# EAGLE design O4MEGA (EAGLE 7.0.0)
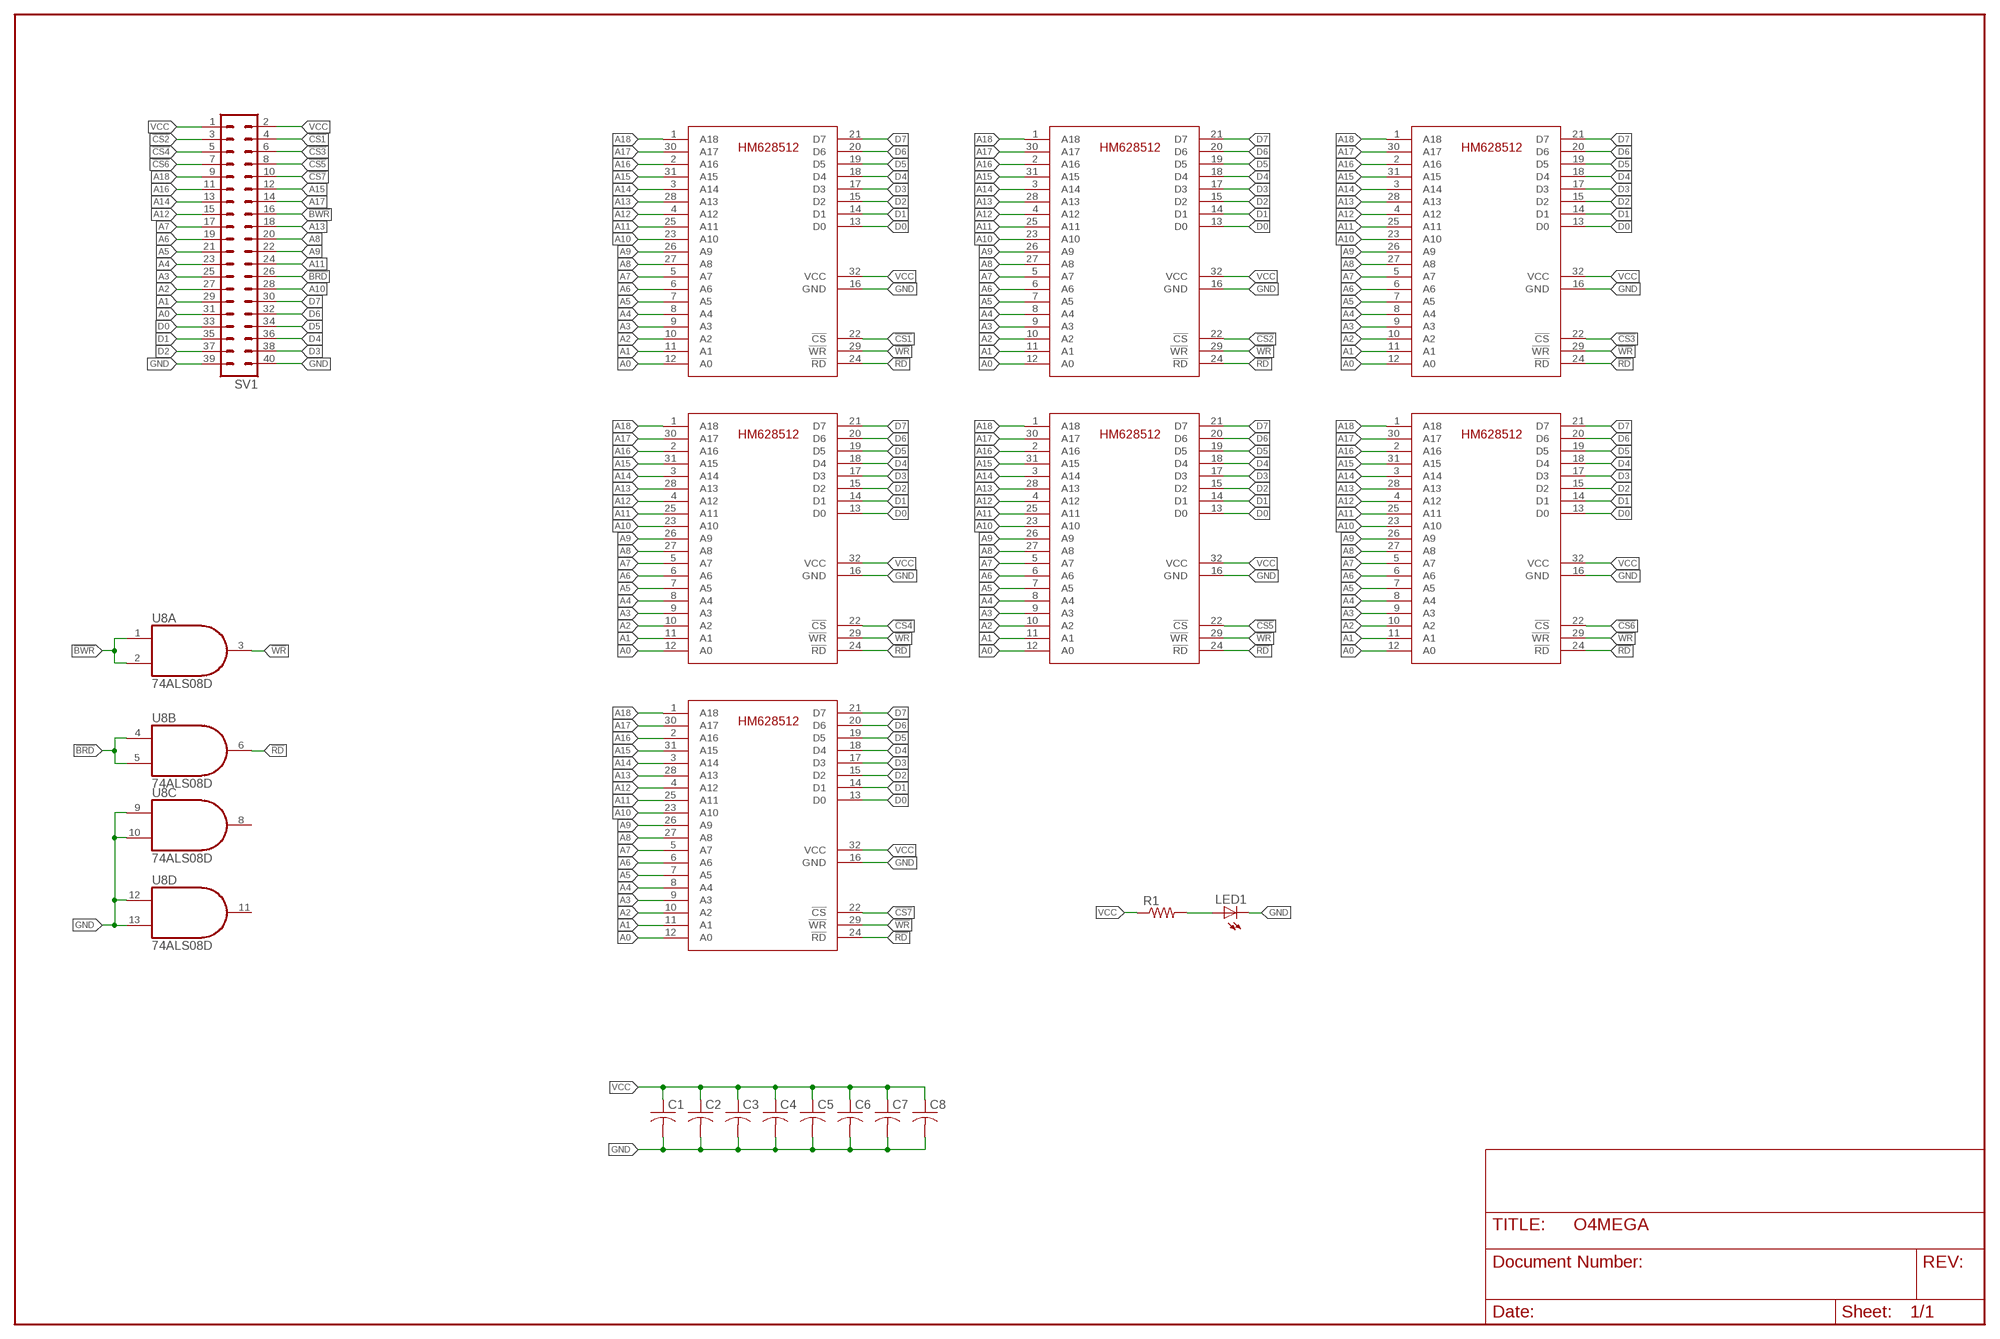
[diagram p0: schematic, sheet 1]

## Parts
C1  C-USC0805K  [C0805K]
C2  C-USC0805K  [C0805K]
C3  C-USC0805K  [C0805K]
C4  C-USC0805K  [C0805K]
C5  C-USC0805K  [C0805K]
C6  C-USC0805K  [C0805K]
C7  C-USC0805K  [C0805K]
C8  C-USC0805K  [C0805K]
LED1  LEDCHIP-LED0805  [CHIP-LED0805]
R1  R-US_M0805  [M0805]
SV1  MA20-2  [MA20-2]
U1  HM628512  [SOP32L]
U2  HM628512  [SOP32L]
U3  HM628512  [SOP32L]
U4  HM628512  [SOP32L]
U5  HM628512  [SOP32L]
U6  HM628512  [SOP32L]
U7  HM628512  [SOP32L]
U8  74ALS08D  [SO14]

## Nets
!BRD: SV1.26 U8.4(B:I0) U8.5(B:I1)
!BWR: SV1.16 U8.1(A:I0) U8.2(A:I1)
!CS1: SV1.4 U1.22(!CS)
!CS2: SV1.3 U2.22(!CS)
!CS3: SV1.6 U3.22(!CS)
!CS4: SV1.5 U4.22(!CS)
!CS5: SV1.8 U5.22(!CS)
!CS6: SV1.7 U6.22(!CS)
!CS7: SV1.10 U7.22(!CS)
!RD: U1.24(!RD) U2.24(!RD) U3.24(!RD) U4.24(!RD) U5.24(!RD) U6.24(!RD) U7.24(!RD) U8.6(B:O)
!WR: U1.29(!WR) U2.29(!WR) U3.29(!WR) U4.29(!WR) U5.29(!WR) U6.29(!WR) U7.29(!WR) U8.3(A:O)
A0: SV1.31 U1.12(A0) U2.12(A0) U3.12(A0) U4.12(A0) U5.12(A0) U6.12(A0) U7.12(A0)
A1: SV1.29 U1.11(A1) U2.11(A1) U3.11(A1) U4.11(A1) U5.11(A1) U6.11(A1) U7.11(A1)
A2: SV1.27 U1.10(A2) U2.10(A2) U3.10(A2) U4.10(A2) U5.10(A2) U6.10(A2) U7.10(A2)
A3: SV1.25 U1.9(A3) U2.9(A3) U3.9(A3) U4.9(A3) U5.9(A3) U6.9(A3) U7.9(A3)
A4: SV1.23 U1.8(A4) U2.8(A4) U3.8(A4) U4.8(A4) U5.8(A4) U6.8(A4) U7.8(A4)
A5: SV1.21 U1.7(A5) U2.7(A5) U3.7(A5) U4.7(A5) U5.7(A5) U6.7(A5) U7.7(A5)
A6: SV1.19 U1.6(A6) U2.6(A6) U3.6(A6) U4.6(A6) U5.6(A6) U6.6(A6) U7.6(A6)
A7: SV1.17 U1.5(A7) U2.5(A7) U3.5(A7) U4.5(A7) U5.5(A7) U6.5(A7) U7.5(A7)
A8: SV1.20 U1.27(A8) U2.27(A8) U3.27(A8) U4.27(A8) U5.27(A8) U6.27(A8) U7.27(A8)
A9: SV1.22 U1.26(A9) U2.26(A9) U3.26(A9) U4.26(A9) U5.26(A9) U6.26(A9) U7.26(A9)
A10: SV1.28 U1.23(A10) U2.23(A10) U3.23(A10) U4.23(A10) U5.23(A10) U6.23(A10) U7.23(A10)
A11: SV1.24 U1.25(A11) U2.25(A11) U3.25(A11) U4.25(A11) U5.25(A11) U6.25(A11) U7.25(A11)
A12: SV1.15 U1.4(A12) U2.4(A12) U3.4(A12) U4.4(A12) U5.4(A12) U6.4(A12) U7.4(A12)
A13: SV1.18 U1.28(A13) U2.28(A13) U3.28(A13) U4.28(A13) U5.28(A13) U6.28(A13) U7.28(A13)
A14: SV1.13 U1.3(A14) U2.3(A14) U3.3(A14) U4.3(A14) U5.3(A14) U6.3(A14) U7.3(A14)
A15: SV1.12 U1.31(A15) U2.31(A15) U3.31(A15) U4.31(A15) U5.31(A15) U6.31(A15) U7.31(A15)
A16: SV1.11 U1.2(A16) U2.2(A16) U3.2(A16) U4.2(A16) U5.2(A16) U6.2(A16) U7.2(A16)
A17: SV1.14 U1.30(A17) U2.30(A17) U3.30(A17) U4.30(A17) U5.30(A17) U6.30(A17) U7.30(A17)
A18: SV1.9 U1.1(A18) U2.1(A18) U3.1(A18) U4.1(A18) U5.1(A18) U6.1(A18) U7.1(A18)
D0: SV1.33 U1.13(D0) U2.13(D0) U3.13(D0) U4.13(D0) U5.13(D0) U6.13(D0) U7.13(D0)
D1: SV1.35 U1.14(D1) U2.14(D1) U3.14(D1) U4.14(D1) U5.14(D1) U6.14(D1) U7.14(D1)
D2: SV1.37 U1.15(D2) U2.15(D2) U3.15(D2) U4.15(D2) U5.15(D2) U6.15(D2) U7.15(D2)
D3: SV1.38 U1.17(D3) U2.17(D3) U3.17(D3) U4.17(D3) U5.17(D3) U6.17(D3) U7.17(D3)
D4: SV1.36 U1.18(D4) U2.18(D4) U3.18(D4) U4.18(D4) U5.18(D4) U6.18(D4) U7.18(D4)
D5: SV1.34 U1.19(D5) U2.19(D5) U3.19(D5) U4.19(D5) U5.19(D5) U6.19(D5) U7.19(D5)
D6: SV1.32 U1.20(D6) U2.20(D6) U3.20(D6) U4.20(D6) U5.20(D6) U6.20(D6) U7.20(D6)
D7: SV1.30 U1.21(D7) U2.21(D7) U3.21(D7) U4.21(D7) U5.21(D7) U6.21(D7) U7.21(D7)
GND: C1.2 C2.2 C3.2 C4.2 C5.2 C6.2 C7.2 C8.2 LED1.C SV1.39 SV1.40 U1.16(GND) U2.16(GND) U3.16(GND) U4.16(GND) U5.16(GND) U6.16(GND) U7.16(GND) U8.9(C:I0) U8.10(C:I1) U8.12(D:I0) U8.13(D:I1)
N$1: LED1.A R1.2
VCC: C1.1 C2.1 C3.1 C4.1 C5.1 C6.1 C7.1 C8.1 R1.1 SV1.1 SV1.2 U1.32(VCC) U2.32(VCC) U3.32(VCC) U4.32(VCC) U5.32(VCC) U6.32(VCC) U7.32(VCC)
Unconnected: U8.8(C:O) U8.11(D:O)

## Power pins joined to a net without a drawn wire
GND: U8.7(P:GND)
VCC: U8.14(P:VCC)

## Library data of the parts
C1-C8 = rcl:C-US: CAPACITOR, American symbol
LED1 = led:LED: LED OSRAM: - CHIPLED LG R971, LG N971, LY N971, LG Q971, LY Q971, LO R971, LY R971 LH N974, LH R974 LS Q976, LO Q976, LY Q976 LO Q996 - Hyper CHIPLED LW Q18S LB Q993, LB Q99A, LB R99A - SideLED LS A670, LO A670, LY A670, LG A670, LP A670 LB A673, LV A673, LT A673, LW A673 LH A674 LY A675 LS A676, LA A676, LO A676, LY A676, LW A676 LS A679, LY A679, LG A679 - Hyper Micro SIDELED® LS Y876, LA Y876, LO Y876, LY Y876 LT Y87S - SmartLED LW L88C, LW L88S LB L89C, LB L89S, LG L890 LS L89K, LO L89K, LY L89K LS L896, LA L896, LO L896, LY L896 - TOPLED LS T670, LO T670, LY T670, LG T670, LP T670 LSG T670, LSP T670, LSY T670, LOP T670, LYG T670 LG T671, LOG T671, LSG T671 LB T673, LV T673, LT T673, LW T673 LH T674 LS T676, LA T676, LO T676, LY T676, LB T676, LH T676, LSB T676, LW T676 LB T67C, LV T67C, LT T67C, LS T67K, LO T67K, LY T67K, LW E67C LS E67B, LA E67B, LO E67B, LY E67B, LB E67C, LV E67C, LT E67C LW T67C LS T679, LY T679, LG T679 LS T770, LO T770, LY T770, LG T770, LP T770 LB T773, LV T773, LT T773, LW T773 LH T774 LS E675, LA E675, LY E675, LS T675 LS T776, LA T776, LO T776, LY T776, LB T776 LHGB T686 LT T68C, LB T68C - Hyper Mini TOPLED® LB M676 - Mini TOPLED Santana® LG M470 LS M47K, LO M47K, LY M47K Source: http://www.osram.convergy.de LUXEON: - LUMILED® LXK2-PW12-R00, LXK2-PW12-S00, LXK2-PW14-U00, LXK2-PW14-V00 LXK2-PM12-R00, LXK2-PM12-S00, LXK2-PM14-U00 LXK2-PE12-Q00, LXK2-PE12-R00, LXK2-PE12-S00, LXK2-PE14-T00, LXK2-PE14-U00 LXK2-PB12-K00, LXK2-PB12-L00, LXK2-PB12-M00, LXK2-PB14-N00, LXK2-PB14-P00, LXK2-PB14-Q00 LXK2-PR12-L00, LXK2-PR12-M00, LXK2-PR14-Q00, LXK2-PR14-R00 LXK2-PD12-Q00, LXK2-PD12-R00, LXK2-PD12-S00 LXK2-PH12-R00, LXK2-PH12-S00 LXK2-PL12-P00, LXK2-PL12-Q00, LXK2-PL12-R00 Source: www.luxeon.com KINGBRIGHT: KA-3528ASYC Source: www.kingbright.com
R1 = rcl:R-US_: RESISTOR, American symbol
SV1 = con-lstb:MA20-2: PIN HEADER; OC_FARNELL: unknown; OC_NEWARK: unknown
U1-U7 = memory:HM628512
U8 = 74xx-us:74*08: Quad 2-input AND gate

## Board
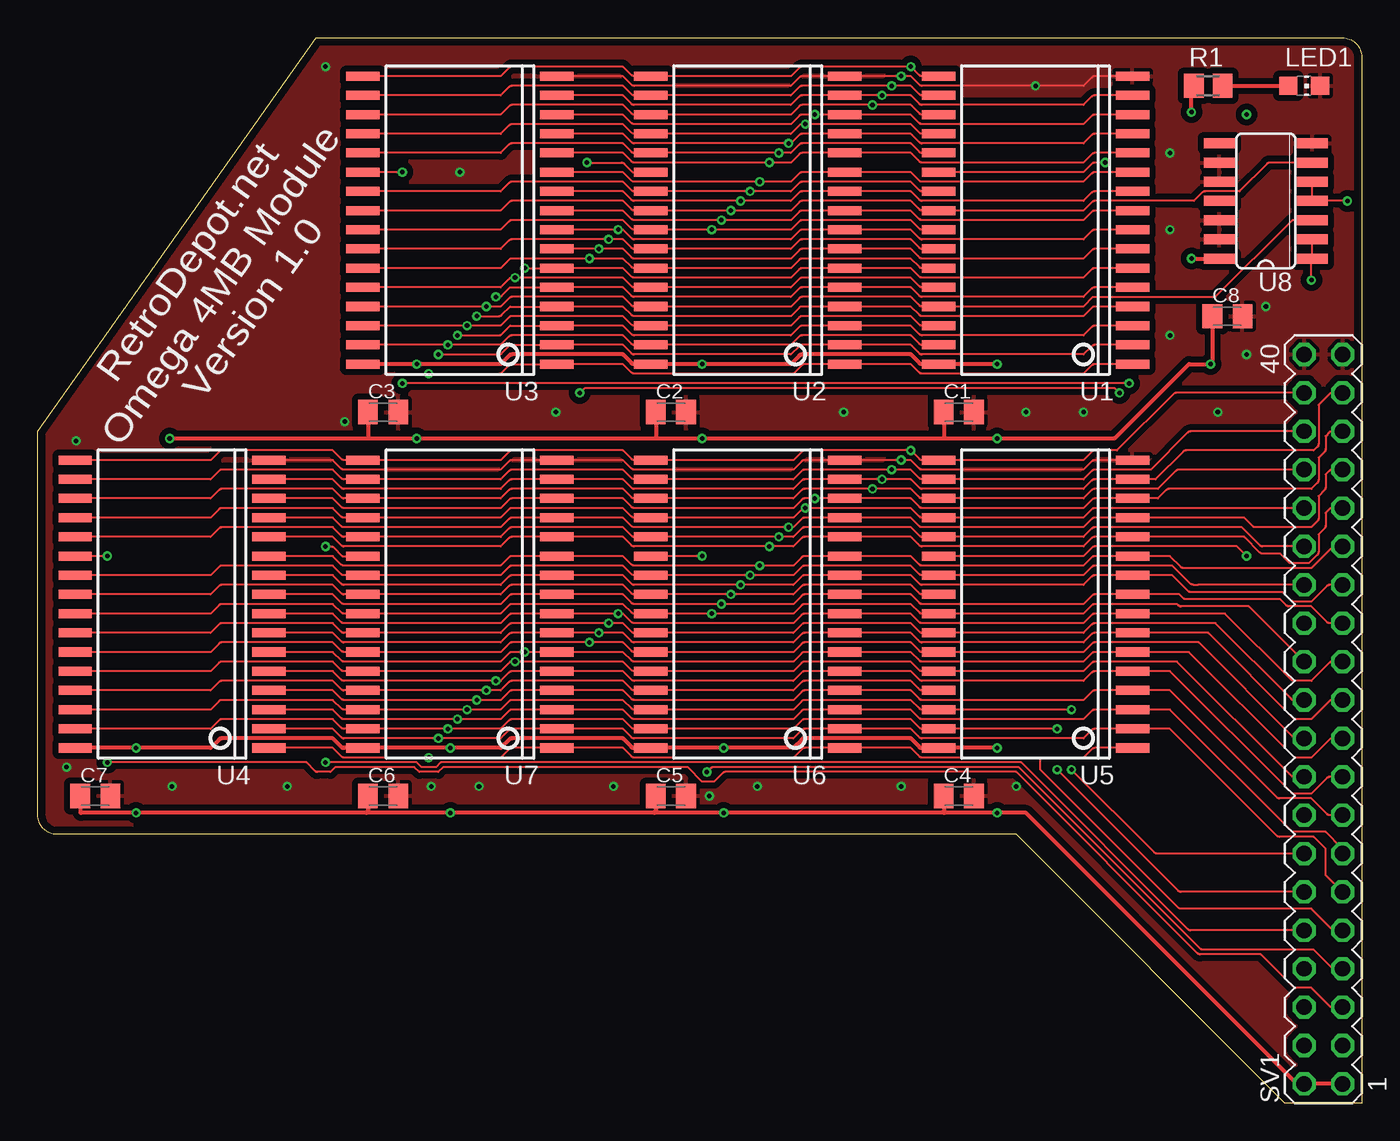
[diagram p1: board, top side]
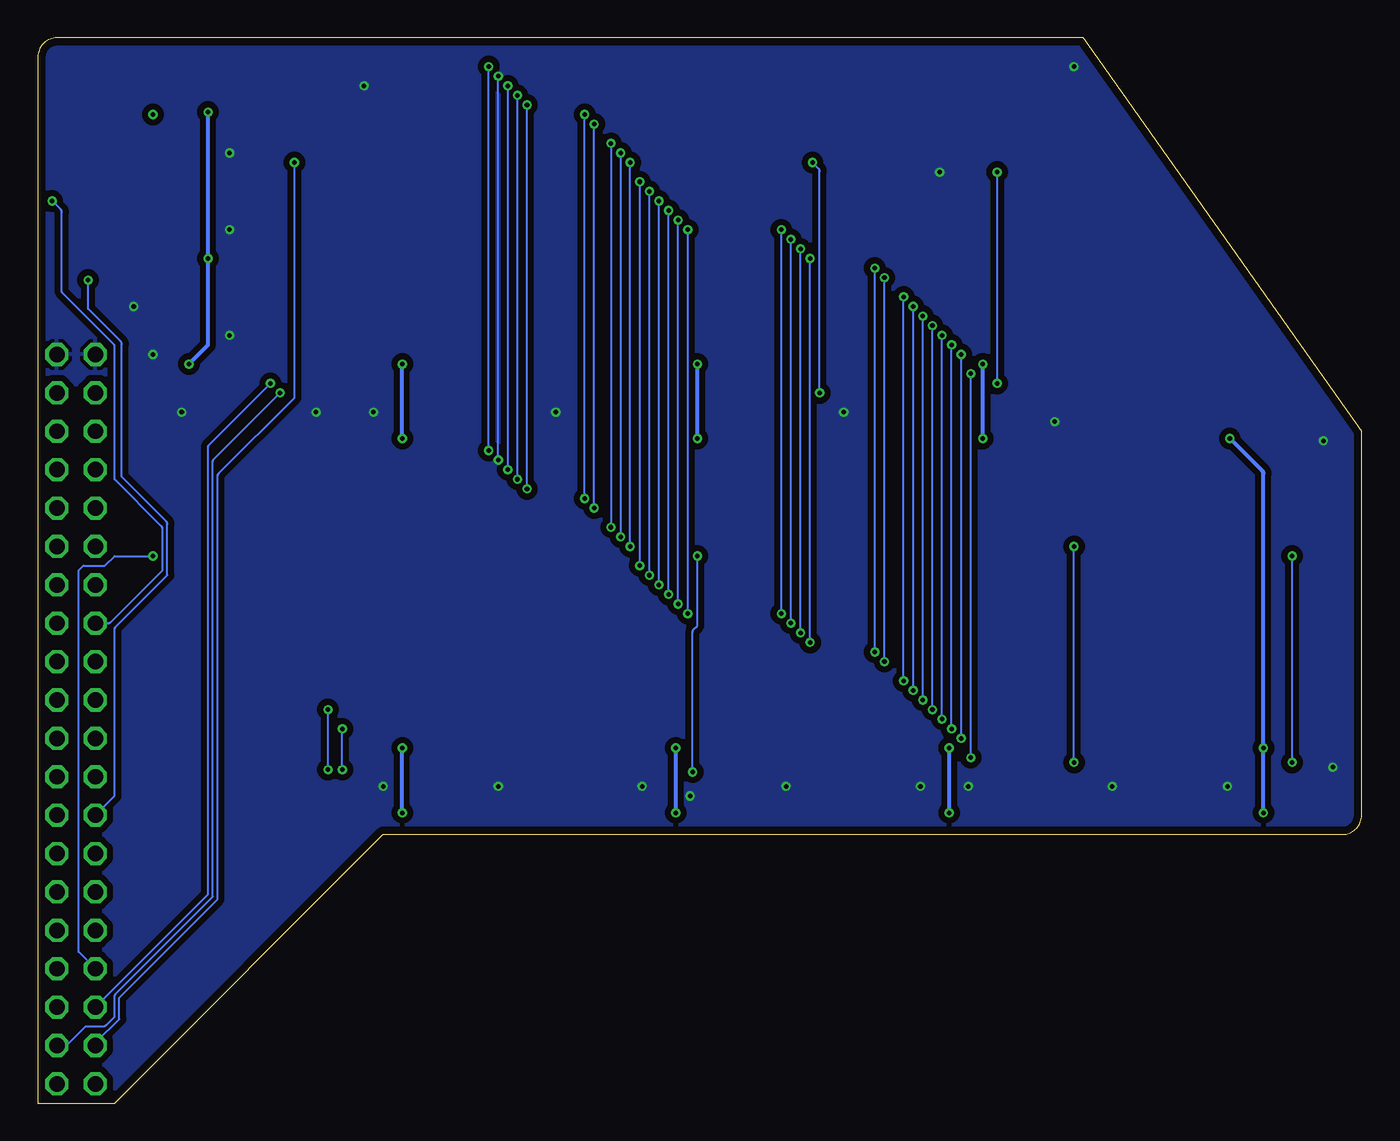
[diagram p2: board, bottom side, seen from below]

Size 87.63 x 70.48 mm. Coordinates in mm from the lower left corner, seen from the top.
Outline: 87.63,0 82.55,0 64.77,17.78 1.27,17.78 arc-90 0,19.05 0,44.45 18.41,70.48 86.36,70.48 arc-90 87.63,69.22 87.63,0
Copper layers (1*16): Top 0.035mm / dielectric 1.5mm / Bottom 0.035mm
Design rules "default *": minimum track width 5mil, minimum drill 0.2mm, track to track 5mil, track to pad 5mil, pad to pad 5mil, via to via 5mil, smd to smd 0mil, copper to edge 20mil, drill to drill 5mil, minimum pad ring 6mil, minimum via ring 6mil, stop-mask expansion 0mil, vias tented up to drill 25mil, thermal gap 10mil

### Footprints (pad centres in the part's own frame; a part is rotated, then mirrored left to right if it is on the bottom)
C0805K = smd 1.3 x 1.6: 1 -1,0; 2 1,0
CHIP-LED0805 = smd 1.2 x 1.2: A 0,-1.05; C 0,1.05
M0805 = smd 1.3 x 1.6: 1 -0.95,0; 2 0.95,0
MA20-2 = drill 1.016 octagon: 1 -24.13,-1.27; 2 -24.13,1.27; 3 -21.59,-1.27; 4 -21.59,1.27; 5 -19.05,-1.27; 6 -19.05,1.27; 7 -16.51,-1.27; 8 -16.51,1.27; 9 -13.97,-1.27; 10 -13.97,1.27; 11 -11.43,-1.27; 12 -11.43,1.27; 13 -8.89,-1.27; 14 -8.89,1.27; 15 -6.35,-1.27; 16 -6.35,1.27; 17 -3.81,-1.27; 18 -3.81,1.27; 19 -1.27,-1.27; 20 -1.27,1.27; 21 1.27,-1.27; 22 1.27,1.27; 23 3.81,-1.27; 24 3.81,1.27; 25 6.35,-1.27; 26 6.35,1.27; 27 8.89,-1.27; 28 8.89,1.27; 29 11.43,-1.27; 30 11.43,1.27; 31 13.97,-1.27; 32 13.97,1.27; 33 16.51,-1.27; 34 16.51,1.27; 35 19.05,-1.27; 36 19.05,1.27; 37 21.59,-1.27; 38 21.59,1.27; 39 24.13,-1.27; 40 24.13,1.27
SOP32L = smd 0.6 x 2.2: 1 -9.525,-6.416; 2 -8.255,-6.416; 3 -6.985,-6.416; 4 -5.715,-6.416; 5 -4.445,-6.416; 6 -3.175,-6.416; 7 -1.905,-6.416; 8 -0.635,-6.416; 9 0.635,-6.416; 10 1.905,-6.416; 11 3.175,-6.416; 12 4.445,-6.416; 13 5.715,-6.416; 14 6.985,-6.416; 15 8.255,-6.416; 16 9.525,-6.416; 17 9.525,6.416; 18 8.255,6.416; 19 6.985,6.416; 20 5.715,6.416; 21 4.445,6.416; 22 3.175,6.416; 23 1.905,6.416; 24 0.635,6.416; 25 -0.635,6.416; 26 -1.905,6.416; 27 -3.175,6.416; 28 -4.445,6.416; 29 -5.715,6.416; 30 -6.985,6.416; 31 -8.255,6.416; 32 -9.525,6.416
SO14 = smd 0.66 x 2.032: 1 -3.81,-3.073; 2 -2.54,-3.073; 3 -1.27,-3.073; 4 0,-3.073; 5 1.27,-3.073; 6 2.54,-3.073; 7 3.81,-3.073; 8 3.81,3.073; 9 2.54,3.073; 10 1.27,3.073; 11 0,3.073; 12 -1.27,3.073; 13 -2.54,3.073; 14 -3.81,3.073

### Placement (x,y rotation side)
C1  60.96,45.72 0 top
C2  41.91,45.72 0 top
C3  22.86,45.72 0 top
C4  60.96,20.32 0 top
C5  41.91,20.32 0 top
C6  22.86,20.32 0 top
C7  3.81,20.32 0 top
C8  78.74,52.07 0 top
LED1  83.82,67.31 270 top
R1  77.47,67.31 0 top
SV1  85.09,25.4 90 top
U1  66.04,58.42 90 top
U2  46.99,58.42 90 top
U3  27.94,58.42 90 top
U4  8.89,33.02 90 top
U5  66.04,33.02 90 top
U6  46.99,33.02 90 top
U7  27.94,33.02 90 top
U8  81.28,59.69 90 top

### Tracks (layer width: path | path; a pad name or v marks a point on that pad's centre or on a via)
!BRD  (via drill 0.3 pad 0.5)
  Top 0.127: v86.68,59.69 U8.4 U8.5
  Bottom 0.127: SV1.26 82.97,31.75 arc-45 82.79,31.82 79.38,35.24 79.38,37.99 arc-45 79.45,38.17 82.55,41.27 82.55,50.06 arc-45 82.62,50.24 86.04,53.66 86.04,58.95 arc-45 86.12,59.13 v86.68,59.69
!BWR  (via drill 0.3 pad 0.5)
  Top 0.127: v84.3,54.45 84.3,55.74 arc-45 U8.1 U8.2
  Bottom 0.127: SV1.16 82.55,20.32 82.55,31.33 arc45 82.48,31.51 79.06,34.92 79.06,38.31 arc-45 79.13,38.49 82.07,41.43 82.07,50.22 arc-45 82.15,50.4 84.3,52.55 v84.3,54.45
!CS1  (via drill 0.3 pad 0.5)
  Top 0.127: v70.64,62.23 69.95,62.23 arc45 69.78,62.16 69.22,61.59 U1.22
  Bottom 0.127: SV1.4 83.82,3.86 arc45 83.75,4.04 82.23,5.56 82.23,6.99 75.72,13.49 75.72,41.49 arc45 75.65,41.67 70.64,46.67 v70.64,62.23
!CS2  (via drill 0.3 pad 0.5)
  Top 0.127: v71.6,46.99 71.28,47.31 36.2,47.31 v35.88,46.99 | v36.35,62.23 38.63,62.23 arc-45 38.81,62.16 39.37,61.59 U2.22
  Bottom 0.127: SV1.3 85.83,3.81 arc-45 85.65,3.88 84.45,5.08 83.29,5.08 arc-45 83.11,5.15 82.55,5.71 82.55,7.04 arc45 82.48,7.22 76.04,13.65 76.04,42.44 arc45 75.97,42.62 v71.6,46.99 | v35.88,46.99 35.88,61.65 arc-45 35.95,61.83 v36.35,62.23
!CS3  (via drill 0.3 pad 0.5)
  Top 0.127: v72.23,47.62 v24.13,47.62 | v24.13,61.59 U3.22
  Bottom 0.127: SV1.6 76.36,13.81 76.36,43.39 arc45 76.28,43.57 v72.23,47.62 | v24.13,47.62 v24.13,61.59
!CS4  (via drill 0.3 pad 0.5)
  Top 0.127: SV1.5 85.67,6.35 arc-45 85.49,6.42 84.3,7.62 83.29,7.62 arc-45 83.11,7.69 80.96,9.84 76.94,9.84 arc-45 76.76,9.92 64.77,21.91 45.51,21.91 arc45 45.33,21.83 44.77,21.27 43.97,21.27 43.02,22.23 26.83,22.23 26.51,21.91 25.24,21.91 24.92,22.23 19.68,22.23 19.37,21.91 18.52,21.91 arc-45 18.34,21.98 17.78,22.54 v4.6,22.54 | v4.6,36.2 U4.22
  Bottom 0.127: v4.6,22.54 v4.6,36.2
!CS5  (via drill 0.3 pad 0.5)
  Top 0.127: v80.01,36.2 79.38,36.83 69.95,36.83 arc45 69.78,36.76 69.22,36.2 U5.22
  Bottom 0.127: SV1.8 84.93,10 84.93,35.24 84.61,35.56 83.19,35.56 82.55,36.2 v80.01,36.2
!CS6  (via drill 0.3 pad 0.5)
  Top 0.127: SV1.7 85.83,8.89 arc-45 85.65,8.96 84.45,10.16 77.1,10.16 arc-45 76.92,10.23 64.93,22.23 44.71,22.23 arc45 44.53,22.15 v44.29,21.91 | v43.97,36.2 U6.22
  Bottom 0.127: v44.29,21.91 44.29,31.17 arc45 44.22,31.35 43.97,31.59 v43.97,36.2
!CS7  (via drill 0.3 pad 0.5)
  Top 0.127: SV1.10 76.31,11.43 arc-45 76.13,11.5 65.09,22.54 26.67,22.54 26.35,22.23 25.4,22.23 25.08,22.54 v19.05,22.54 | v19.05,36.83 19.42,36.83 arc-45 19.6,36.76 20.16,36.2 U7.22
  Bottom 0.127: v19.05,22.54 v19.05,36.83
!RD  (via drill 0.3 pad 0.5)
  Top 0.127: U3.24 30.64,59.05 31.2,59.62 arc-45 31.38,59.69 38.73,59.69 39.3,59.13 arc45 39.48,59.05 U2.24 v45.88,59.05 49.85,59.05 50.41,59.62 arc-45 50.59,59.69 57.78,59.69 58.35,59.13 arc45 58.52,59.05 U1.24 69.22,59.05 69.78,59.62 arc-45 69.95,59.69 76.52,59.69 77.08,60.25 arc-45 77.26,60.33 79.53,60.33 81.36,62.16 arc-45 81.54,62.23 U8.6 | U5.24 58.52,33.66 arc-45 58.35,33.73 57.78,34.29 50.75,34.29 arc45 50.57,34.22 50.01,33.66 v45.88,33.66 U6.24 39.48,33.66 arc-45 39.3,33.73 38.73,34.29 31.38,34.29 arc45 31.2,34.22 30.64,33.66 U7.24 20.27,33.66 arc-45 20.09,33.73 19.53,34.29 12.17,34.29 arc45 11.99,34.22 11.43,33.66 U4.24
  Bottom 0.127: v45.88,33.66 v45.88,59.05
!WR  (via drill 0.3 pad 0.5)
  Top 0.127: U3.29 v29.69,52.7 30.64,52.7 31.2,53.27 arc-45 31.38,53.34 38.73,53.34 39.3,52.78 arc45 39.48,52.7 U2.29 49.85,52.7 50.41,53.27 arc-45 50.59,53.34 57.78,53.34 58.35,52.78 arc45 58.52,52.7 U1.29 69.22,52.7 69.85,53.34 77.95,53.34 82.95,58.35 arc-45 83.13,58.42 U8.3 | U5.29 58.52,27.3 arc-45 58.35,27.38 57.78,27.94 50.75,27.94 arc45 50.57,27.87 50.01,27.3 U6.29 39.48,27.3 arc-45 39.3,27.38 38.73,27.94 31.38,27.94 arc45 31.2,27.87 30.64,27.3 v29.69,27.3 U7.29 20.27,27.3 arc-45 20.09,27.38 19.53,27.94 12.17,27.94 arc45 11.99,27.87 11.43,27.3 U4.29
  Bottom 0.127: v29.69,27.3 v29.69,52.7
A0  (via drill 0.3 pad 0.5)
  Top 0.127: U1.12 69.95,62.87 arc45 69.78,62.79 69.22,62.23 58.52,62.23 arc-45 58.35,62.3 57.78,62.87 U2.12 50.59,62.87 arc45 50.41,62.79 49.85,62.23 v48.42,62.23 39.48,62.23 arc-45 39.3,62.3 38.73,62.87 U3.12 | U4.12 19.53,37.47 20.09,36.9 arc45 20.27,36.83 30.64,36.83 31.2,37.39 arc-45 31.38,37.47 U7.12 38.73,37.47 39.3,36.9 arc45 39.48,36.83 v48.42,36.83 50.01,36.83 50.57,37.39 arc-45 50.75,37.47 U6.12 57.78,37.47 58.35,36.9 arc45 58.52,36.83 69.22,36.83 69.78,37.39 arc-45 69.95,37.47 U5.12 79.85,37.47 80.89,36.43 arc45 81.07,36.35 82.23,36.35 82.79,35.79 arc45 82.97,35.72 84.14,35.72 84.7,36.28 arc45 84.77,36.46 84.77,37.62 85.17,38.03 arc45 85.25,38.2 85.25,39.05 85.49,39.3 arc-45 85.67,39.37 SV1.31
  Bottom 0.127: v48.42,36.83 v48.42,62.23
A1  (via drill 0.3 pad 0.5)
  Top 0.127: U1.11 69.95,61.59 arc45 69.78,61.52 69.22,60.96 58.52,60.96 arc-45 58.35,61.03 57.78,61.59 U2.11 50.59,61.59 arc45 50.41,61.52 49.85,60.96 v47.78,60.96 39.48,60.96 arc-45 39.3,61.03 38.73,61.59 U3.11 | U4.11 19.53,36.2 20.09,35.63 arc45 20.27,35.56 30.64,35.56 31.2,36.12 arc-45 31.38,36.2 U7.11 38.73,36.2 39.3,35.63 arc45 39.48,35.56 v47.78,35.56 50.01,35.56 50.57,36.12 arc-45 50.75,36.2 U6.11 57.78,36.2 58.35,35.63 arc45 58.52,35.56 69.22,35.56 69.78,36.12 arc-45 69.95,36.2 U5.11 74.93,36.2 75.65,35.48 arc45 75.83,35.4 84.3,35.4 85.65,36.76 arc-45 85.83,36.83 SV1.29
  Bottom 0.127: v47.78,35.56 v47.78,60.96
A2  (via drill 0.3 pad 0.5)
  Top 0.127: U1.10 69.95,60.33 arc45 69.78,60.25 69.22,59.69 58.52,59.69 arc-45 58.35,59.76 57.78,60.33 U2.10 50.59,60.33 arc45 50.41,60.25 49.85,59.69 v46.51,59.69 39.48,59.69 arc-45 39.3,59.76 38.73,60.33 U3.10 | U4.10 19.53,34.92 20.09,34.36 arc45 20.27,34.29 30.64,34.29 31.2,34.85 arc-45 31.38,34.92 U7.10 38.73,34.92 39.3,34.36 arc45 39.48,34.29 v46.51,34.29 50.01,34.29 50.57,34.85 arc-45 50.75,34.92 U6.10 57.78,34.92 58.35,34.36 arc45 58.52,34.29 69.22,34.29 69.78,34.85 arc-45 69.95,34.92 U5.10 75.09,34.92 76.13,33.89 arc45 76.31,33.81 82.39,33.81 82.95,33.25 arc45 83.13,33.18 84.3,33.18 85.33,34.22 arc-45 85.51,34.29 SV1.27
  Bottom 0.127: v46.51,34.29 v46.51,59.69
A3  (via drill 0.3 pad 0.5)
  Top 0.127: U1.9 69.95,59.05 arc45 69.78,58.98 69.22,58.42 58.52,58.42 arc-45 58.35,58.49 57.78,59.05 U2.9 50.59,59.05 arc45 50.41,58.98 49.85,58.42 v45.24,58.42 39.48,58.42 arc-45 39.3,58.49 38.73,59.05 U3.9 | U4.9 19.53,33.66 20.09,33.09 arc45 20.27,33.02 30.64,33.02 31.2,33.58 arc-45 31.38,33.66 U7.9 38.73,33.66 39.3,33.09 arc45 39.48,33.02 v45.24,33.02 50.01,33.02 50.57,33.58 arc-45 50.75,33.66 U6.9 57.78,33.66 58.35,33.09 arc45 58.52,33.02 69.22,33.02 69.78,33.58 arc-45 69.95,33.66 U5.9 75.56,33.66 75.81,33.41 arc45 75.99,33.34 82.23,33.34 82.63,32.94 arc45 82.81,32.86 84.3,32.86 85.33,31.82 arc45 85.51,31.75 SV1.25
  Bottom 0.127: v45.24,33.02 v45.24,58.42
A4  (via drill 0.3 pad 0.5)
  Top 0.127: U1.8 69.95,57.78 arc45 69.78,57.71 69.22,57.15 58.52,57.15 arc-45 58.35,57.22 57.78,57.78 U2.8 50.59,57.78 arc45 50.41,57.71 49.85,57.15 39.48,57.15 arc-45 39.3,57.22 38.73,57.78 v38.42,57.78 U3.8 | U4.8 19.53,32.38 20.09,31.82 arc45 20.27,31.75 30.64,31.75 31.2,32.31 arc-45 31.38,32.38 U7.8 v38.42,32.38 38.73,32.38 39.3,31.82 arc45 39.48,31.75 50.01,31.75 50.57,32.31 arc-45 50.75,32.38 U6.8 57.78,32.38 58.35,31.82 arc45 58.52,31.75 69.22,31.75 69.78,32.31 arc-45 69.95,32.38 U5.8 78.58,32.38 82.95,28.01 arc45 83.13,27.94 84.3,27.94 85.49,29.14 arc-45 85.67,29.21 SV1.23
  Bottom 0.127: v38.42,32.38 v38.42,57.78
A5  (via drill 0.3 pad 0.5)
  Top 0.127: U1.7 69.95,56.52 arc45 69.78,56.44 69.22,55.88 58.52,55.88 arc-45 58.35,55.95 57.78,56.52 U2.7 50.59,56.52 arc45 50.41,56.44 49.85,55.88 39.48,55.88 arc-45 39.3,55.95 38.73,56.52 v37.15,56.52 U3.7 | U4.7 19.53,31.11 20.09,30.55 arc45 20.27,30.48 30.64,30.48 31.2,31.04 arc-45 31.38,31.11 U7.7 v37.15,31.11 38.73,31.11 39.3,30.55 arc45 39.48,30.48 50.01,30.48 50.57,31.04 arc-45 50.75,31.11 U6.7 57.78,31.11 58.35,30.55 arc45 58.52,30.48 69.22,30.48 69.78,31.04 arc-45 69.95,31.11 U5.7 77.47,31.11 83.11,25.47 arc45 83.29,25.4 84.3,25.4 85.49,26.6 arc-45 85.67,26.67 SV1.21
  Bottom 0.127: v37.15,31.11 v37.15,56.52
A6  (via drill 0.3 pad 0.5)
  Top 0.127: U1.6 69.95,55.24 arc45 69.78,55.17 69.22,54.61 58.52,54.61 arc-45 58.35,54.68 57.78,55.24 U2.6 50.59,55.24 arc45 50.41,55.17 49.85,54.61 39.48,54.61 arc-45 39.3,54.68 38.73,55.24 U3.6 v32.23,55.24 | U4.6 19.53,29.84 20.09,29.28 arc45 20.27,29.21 30.64,29.21 31.2,29.77 arc-45 31.38,29.84 v32.23,29.84 U7.6 38.73,29.84 39.3,29.28 arc45 39.48,29.21 50.01,29.21 50.57,29.77 arc-45 50.75,29.84 U6.6 57.78,29.84 58.35,29.28 arc45 58.52,29.21 69.22,29.21 69.78,29.77 arc-45 69.95,29.84 U5.6 76.2,29.84 83.11,22.93 arc45 83.29,22.86 84.3,22.86 85.49,24.06 arc-45 85.67,24.13 SV1.19
  Bottom 0.127: v32.23,29.84 v32.23,55.24
A7  (via drill 0.3 pad 0.5)
  Top 0.127: U1.5 69.95,53.98 arc45 69.78,53.9 69.22,53.34 58.52,53.34 arc-45 58.35,53.41 57.78,53.98 U2.5 50.59,53.98 arc45 50.41,53.9 49.85,53.34 39.48,53.34 arc-45 39.3,53.41 38.73,53.98 U3.5 31.27,53.98 30.71,53.41 arc-45 30.53,53.34 v30.32,53.34 | U4.5 19.53,28.57 20.09,28.01 arc45 20.27,27.94 v30.32,27.94 30.64,27.94 31.2,28.5 arc-45 31.38,28.57 U7.5 38.73,28.57 39.3,28.01 arc45 39.48,27.94 50.01,27.94 50.57,28.5 arc-45 50.75,28.57 U6.5 57.78,28.57 58.35,28.01 arc45 58.52,27.94 69.22,27.94 69.78,28.5 arc-45 69.95,28.57 U5.5 74.93,28.57 82.95,20.55 arc45 83.13,20.48 84.3,20.48 85.33,21.52 arc-45 85.51,21.59 SV1.17
  Bottom 0.127: v30.32,27.94 v30.32,53.34
A8  (via drill 0.3 pad 0.5)
  Top 0.127: U1.27 58.52,55.24 arc-45 58.35,55.32 57.78,55.88 50.59,55.88 arc45 50.41,55.81 49.85,55.24 U2.27 39.48,55.24 arc-45 39.3,55.32 38.73,55.88 v36.51,55.88 31.38,55.88 arc45 31.2,55.81 30.64,55.24 U3.27 | U4.27 11.43,29.84 11.99,30.41 arc-45 12.17,30.48 19.53,30.48 20.09,29.92 arc45 20.27,29.84 U7.27 30.64,29.84 31.2,30.41 arc-45 31.38,30.48 v36.51,30.48 38.73,30.48 39.3,29.92 arc45 39.48,29.84 U6.27 50.01,29.84 50.57,30.41 arc-45 50.75,30.48 57.78,30.48 58.35,29.92 arc45 58.52,29.84 U5.27 69.22,29.84 69.78,30.41 arc-45 69.95,30.48 76.83,30.48 83.11,24.2 arc45 83.29,24.13 SV1.20
  Bottom 0.127: v36.51,30.48 v36.51,55.88
A9  (via drill 0.3 pad 0.5)
  Top 0.127: U1.26 58.52,56.52 arc-45 58.35,56.59 57.78,57.15 50.59,57.15 arc45 50.41,57.08 49.85,56.52 U2.26 39.48,56.52 arc-45 39.3,56.59 38.73,57.15 v37.78,57.15 31.38,57.15 arc45 31.2,57.08 30.64,56.52 U3.26 | U4.26 11.43,31.11 11.99,31.68 arc-45 12.17,31.75 19.53,31.75 20.09,31.19 arc45 20.27,31.11 U7.26 30.64,31.11 31.2,31.68 arc-45 31.38,31.75 v37.78,31.75 38.73,31.75 39.3,31.19 arc45 39.48,31.11 U6.26 50.01,31.11 50.57,31.68 arc-45 50.75,31.75 57.78,31.75 58.35,31.19 arc45 58.52,31.11 U5.26 69.22,31.11 69.78,31.68 arc-45 69.95,31.75 77.95,31.75 82.95,26.74 arc45 83.13,26.67 SV1.22
  Bottom 0.127: v37.78,31.75 v37.78,57.15
A10  (via drill 0.3 pad 0.5)
  Top 0.127: U1.23 58.52,60.33 arc-45 58.35,60.4 57.78,60.96 50.59,60.96 arc45 50.41,60.89 49.85,60.33 v47.15,60.33 U2.23 39.48,60.33 arc-45 39.3,60.4 38.73,60.96 31.38,60.96 arc45 31.2,60.89 30.64,60.33 U3.23 | U4.23 11.43,34.92 11.99,35.49 arc-45 12.17,35.56 19.53,35.56 20.09,35 arc45 20.27,34.92 U7.23 30.64,34.92 31.2,35.49 arc-45 31.38,35.56 38.73,35.56 39.3,35 arc45 39.48,34.92 U6.23 v47.15,34.92 50.01,34.92 50.57,35.49 arc-45 50.75,35.56 57.78,35.56 58.35,35 arc45 58.52,34.92 U5.23 69.22,34.92 69.78,35.49 arc-45 69.95,35.56 75.09,35.56 76.28,34.36 arc45 76.78,34.29 SV1.28
  Bottom 0.127: v47.15,34.92 v47.15,60.33
A11  (via drill 0.3 pad 0.5)
  Top 0.127: U1.25 58.52,57.78 arc-45 58.35,57.86 57.78,58.42 50.59,58.42 arc45 50.41,58.35 49.85,57.78 v44.61,57.78 U2.25 39.48,57.78 arc-45 39.3,57.86 38.73,58.42 31.38,58.42 arc45 31.2,58.35 30.64,57.78 U3.25 | U4.25 11.43,32.38 11.99,32.95 arc-45 12.17,33.02 19.53,33.02 20.09,32.46 arc45 20.27,32.38 U7.25 30.64,32.38 31.2,32.95 arc-45 31.38,33.02 38.73,33.02 39.3,32.46 arc45 39.48,32.38 U6.25 v44.61,32.38 50.01,32.38 50.57,32.95 arc-45 50.75,33.02 57.78,33.02 58.35,32.46 arc45 58.52,32.38 U5.25 69.22,32.38 69.78,32.95 arc-45 69.95,33.02 75.41,33.02 75.49,32.94 arc45 75.67,32.86 80.17,32.86 SV1.24
  Bottom 0.127: v44.61,32.38 v44.61,57.78
A12  (via drill 0.3 pad 0.5)
  Top 0.127: U1.4 69.95,52.7 arc45 69.78,52.63 69.22,52.07 58.52,52.07 arc-45 58.35,52.14 57.78,52.7 U2.4 50.59,52.7 arc45 50.41,52.63 49.85,52.07 39.48,52.07 arc-45 39.3,52.14 38.73,52.7 U3.4 31.27,52.7 30.71,52.14 arc-45 30.53,52.07 v29.05,52.07 | U4.4 19.53,27.3 20.09,26.74 arc45 20.27,26.67 v29.05,26.67 30.64,26.67 31.2,27.23 arc-45 31.38,27.3 U7.4 38.73,27.3 39.3,26.74 arc45 39.48,26.67 50.01,26.67 50.57,27.23 arc-45 50.75,27.3 U6.4 57.78,27.3 58.35,26.74 arc45 58.52,26.67 69.22,26.67 69.78,27.23 arc-45 69.95,27.3 U5.4 74.93,27.3 82,20.24 arc45 82.18,20.16 84.3,20.16 85.33,19.12 arc45 85.51,19.05 SV1.15
  Bottom 0.127: v29.05,26.67 v29.05,52.07
A13  (via drill 0.3 pad 0.5)
  Top 0.127: U1.28 58.52,53.98 arc-45 58.35,54.05 57.78,54.61 50.59,54.61 arc45 50.41,54.54 49.85,53.98 U2.28 39.48,53.98 arc-45 39.3,54.05 38.73,54.61 v31.59,54.61 31.38,54.61 arc45 31.2,54.54 30.64,53.98 U3.28 | U4.28 11.43,28.57 11.99,29.14 arc-45 12.17,29.21 19.53,29.21 20.09,28.65 arc45 20.27,28.57 U7.28 30.64,28.57 31.2,29.14 arc-45 31.38,29.21 v31.59,29.21 38.73,29.21 39.3,28.65 arc45 39.48,28.57 U6.28 50.01,28.57 50.57,29.14 arc-45 50.75,29.21 57.78,29.21 58.35,28.65 arc45 58.52,28.57 U5.28 69.22,28.57 69.78,29.14 arc-45 69.95,29.21 75.41,29.21 82.95,21.66 arc45 83.13,21.59 SV1.18
  Bottom 0.127: v31.59,29.21 v31.59,54.61
A14  (via drill 0.3 pad 0.5)
  Top 0.127: U1.3 69.95,51.44 arc45 69.78,51.36 69.22,50.8 58.52,50.8 arc-45 58.35,50.87 57.78,51.44 U2.3 50.59,51.44 arc45 50.41,51.36 49.85,50.8 39.48,50.8 arc-45 39.3,50.87 38.73,51.44 U3.3 31.27,51.44 30.71,50.87 arc-45 30.53,50.8 v27.78,50.8 | U4.3 19.53,26.04 20.09,25.47 arc45 20.27,25.4 v27.78,25.4 30.64,25.4 31.2,25.96 arc-45 31.38,26.04 U7.3 38.73,26.04 39.3,25.47 arc45 39.48,25.4 50.01,25.4 50.57,25.96 arc-45 50.75,26.04 U6.3 57.78,26.04 58.35,25.47 arc45 58.52,25.4 69.22,25.4 69.78,25.96 arc-45 69.95,26.04 U5.3 74.93,26.04 82.95,18.01 arc45 83.13,17.94 85.25,17.94 86.29,16.9 arc-45 86.36,16.72 SV1.13
  Bottom 0.127: v27.78,25.4 v27.78,50.8
A15  (via drill 0.3 pad 0.5)
  Top 0.127: U1.31 58.52,50.16 arc-45 58.35,50.24 57.78,50.8 50.59,50.8 arc45 50.41,50.73 49.85,50.16 U2.31 39.48,50.16 arc-45 39.3,50.24 38.73,50.8 31.38,50.8 arc45 31.2,50.73 30.64,50.16 v27.15,50.16 U3.31 | U4.31 11.43,24.77 11.99,25.33 arc-45 12.17,25.4 19.53,25.4 20.09,24.84 arc45 20.27,24.77 U7.31 v27.15,24.77 30.64,24.77 31.2,25.33 arc-45 31.38,25.4 38.73,25.4 39.3,24.84 arc45 39.48,24.77 U6.31 50.01,24.77 50.57,25.33 arc-45 50.75,25.4 57.78,25.4 58.35,24.84 arc45 58.52,24.77 U5.31 v67.47,24.77 | SV1.12 75.67,13.97 arc-45 75.49,14.04 v67.47,22.07
  Bottom 0.127: v27.15,24.77 v27.15,50.16 | v67.47,22.07 v67.47,24.77
A16  (via drill 0.3 pad 0.5)
  Top 0.127: U1.2 69.95,50.16 arc45 69.78,50.09 69.22,49.53 58.52,49.53 arc-45 58.35,49.6 57.78,50.16 U2.2 50.59,50.16 arc45 50.41,50.09 49.85,49.53 39.48,49.53 arc-45 39.3,49.6 38.73,50.16 U3.2 31.27,50.16 30.71,49.6 arc-45 30.53,49.53 v26.51,49.53 | U4.2 19.53,24.77 20.09,24.2 arc45 20.27,24.13 v26.51,24.13 30.64,24.13 31.2,24.69 arc-45 31.38,24.77 U7.2 38.73,24.77 39.3,24.2 arc45 39.48,24.13 50.01,24.13 50.57,24.69 arc-45 50.75,24.77 U6.2 57.78,24.77 58.35,24.2 arc45 58.52,24.13 69.22,24.13 69.78,24.69 arc-45 69.95,24.77 U5.2 74.93,24.77 82,17.7 arc45 82.18,17.62 84.45,17.62 85.25,16.83 85.25,15.08 SV1.11
  Bottom 0.127: v26.51,24.13 v26.51,49.53
A17  (via drill 0.3 pad 0.5)
  Top 0.127: U1.30 58.52,51.44 arc-45 58.35,51.51 57.78,52.07 50.59,52.07 arc45 50.41,52 49.85,51.44 U2.30 39.48,51.44 arc-45 39.3,51.51 38.73,52.07 31.38,52.07 arc45 31.2,52 30.64,51.44 v28.42,51.44 U3.30 | U4.30 11.43,26.04 11.99,26.6 arc-45 12.17,26.67 19.53,26.67 20.09,26.11 arc45 20.27,26.04 U7.30 v28.42,26.04 30.64,26.04 31.2,26.6 arc-45 31.38,26.67 38.73,26.67 39.3,26.11 arc45 39.48,26.04 U6.30 50.01,26.04 50.57,26.6 arc-45 50.75,26.67 57.78,26.67 58.35,26.11 arc45 58.52,26.04 U5.30 v68.42,26.04 | SV1.14 74.08,16.51 arc-45 73.9,16.58 v68.42,22.07
  Bottom 0.127: v28.42,26.04 v28.42,51.44 | v68.42,22.07 v68.42,26.04
A18  (via drill 0.3 pad 0.5)
  Top 0.127: U1.1 69.95,48.9 arc45 69.78,48.82 69.22,48.26 58.52,48.26 arc-45 58.35,48.33 57.78,48.9 U2.1 50.75,48.9 arc45 50.57,48.82 50.01,48.26 39.48,48.26 arc-45 39.3,48.33 38.73,48.9 U3.1 31.27,48.9 30.71,48.33 arc-45 30.53,48.26 v25.88,48.26 | U5.1 69.95,23.5 arc45 69.78,23.42 69.22,22.86 66.36,22.86 | 66.36,22.86 58.52,22.86 arc-45 58.35,22.93 57.78,23.5 U6.1 50.75,23.5 arc45 50.57,23.42 50.01,22.86 39.48,22.86 arc-45 39.3,22.93 38.73,23.5 U7.1 31.38,23.5 arc45 31.2,23.42 30.64,22.86 v25.88,22.86 20.27,22.86 arc-45 20.09,22.93 19.53,23.5 U4.1 | SV1.9 85.83,11.43 arc-45 85.65,11.5 84.3,12.86 75.67,12.86 arc-45 75.49,12.93 66.36,22.07 66.36,22.86
  Bottom 0.127: v25.88,22.86 v25.88,48.26
D0  (via drill 0.3 pad 0.5)
  Top 0.127: U1.13 69.95,64.14 arc45 69.78,64.06 69.22,63.5 58.52,63.5 arc-45 58.35,63.57 57.78,64.14 U2.13 50.59,64.14 arc45 50.41,64.06 49.85,63.5 v49.69,63.5 39.48,63.5 arc-45 39.3,63.57 38.73,64.14 U3.13 | U4.13 19.53,38.73 20.09,38.17 arc45 20.27,38.1 30.64,38.1 31.2,38.66 arc-45 31.38,38.73 U7.13 38.73,38.73 39.3,38.17 arc45 39.48,38.1 v49.69,38.1 50.01,38.1 50.57,38.66 arc-45 50.75,38.73 U6.13 57.78,38.73 58.35,38.17 arc45 58.52,38.1 69.22,38.1 69.78,38.66 arc-45 69.95,38.73 U5.13 79.85,38.73 80.41,38.17 arc45 80.59,38.1 84.3,38.1 84.7,38.5 arc45 84.77,38.68 84.77,40.16 85.17,40.57 arc45 85.25,40.74 85.25,41.59 85.49,41.84 arc-45 85.67,41.91 SV1.33
  Bottom 0.127: v49.69,63.5 v49.69,38.1
D1  (via drill 0.3 pad 0.5)
  Top 0.127: U1.14 69.95,65.41 arc45 69.78,65.33 69.22,64.77 58.52,64.77 arc-45 58.35,64.84 57.78,65.41 U2.14 v51.44,65.41 50.59,65.41 arc45 50.41,65.33 49.85,64.77 39.48,64.77 arc-45 39.3,64.84 38.73,65.41 U3.14 | U4.14 19.53,40.01 20.09,39.44 arc45 20.27,39.37 30.64,39.37 31.2,39.93 arc-45 31.38,40.01 U7.14 38.73,40.01 39.3,39.44 arc45 39.48,39.37 50.01,39.37 50.57,39.93 arc-45 50.75,40.01 v51.44,40.01 U6.14 57.78,40.01 58.35,39.44 arc45 58.52,39.37 69.22,39.37 69.78,39.93 arc-45 69.95,40.01 U5.14 74.14,40.01 74.7,40.57 arc-45 74.88,40.64 84.3,40.64 84.7,41.04 arc45 84.77,41.22 84.77,42.7 85.17,43.11 arc45 85.25,43.28 85.25,44.13 85.49,44.38 arc-45 85.67,44.45 SV1.35
  Bottom 0.127: v51.44,40.01 v51.44,65.41
D2  (via drill 0.3 pad 0.5)
  Top 0.127: U1.15 69.95,66.67 arc45 69.78,66.6 69.22,66.04 58.52,66.04 arc-45 58.35,66.11 57.78,66.67 v55.88,66.67 U2.15 50.59,66.67 arc45 50.41,66.6 49.85,66.04 39.48,66.04 arc-45 39.3,66.11 38.73,66.67 U3.15 | U4.15 19.53,41.27 20.09,40.71 arc45 20.27,40.64 30.64,40.64 31.2,41.2 arc-45 31.38,41.27 U7.15 38.73,41.27 39.3,40.71 arc45 39.48,40.64 50.01,40.64 50.57,41.2 arc-45 50.75,41.27 U6.15 v55.88,41.27 57.78,41.27 58.35,40.71 arc45 58.52,40.64 69.22,40.64 69.78,41.2 arc-45 69.95,41.27 U5.15 73.98,41.27 75.81,43.11 arc-45 75.99,43.18 84.45,43.18 84.7,43.42 arc45 84.77,43.6 84.77,46.2 85.49,46.92 arc-45 85.67,46.99 SV1.37
  Bottom 0.127: v55.88,41.27 v55.88,66.67
D3  (via drill 0.3 pad 0.5)
  Top 0.127: U1.17 58.52,67.94 arc-45 58.35,68.02 v57.78,68.58 50.59,68.58 arc45 50.41,68.51 49.85,67.94 U2.17 39.48,67.94 arc-45 39.3,68.02 38.73,68.58 31.38,68.58 arc45 31.2,68.51 30.64,67.94 U3.17 | U4.17 11.43,42.55 11.99,43.11 arc-45 12.17,43.18 19.53,43.18 20.09,42.62 arc45 20.27,42.55 U7.17 30.64,42.55 31.2,43.11 arc-45 31.38,43.18 38.73,43.18 39.3,42.62 arc45 39.48,42.55 U6.17 50.01,42.55 50.57,43.11 arc-45 50.75,43.18 v57.78,43.18 58.35,42.62 arc45 58.52,42.55 U5.17 69.22,42.55 69.78,43.11 arc-45 69.95,43.18 71.44,43.18 75.17,46.92 arc-45 75.35,46.99 SV1.38
  Bottom 0.127: v57.78,43.18 v57.78,68.58
D4  (via drill 0.3 pad 0.5)
  Top 0.127: U1.18 58.52,66.67 arc-45 58.35,66.75 57.78,67.31 v56.52,67.31 50.59,67.31 arc45 50.41,67.24 49.85,66.67 U2.18 39.48,66.67 arc-45 39.3,66.75 38.73,67.31 31.38,67.31 arc45 31.2,67.24 30.64,66.67 U3.18 | U4.18 11.43,41.27 11.99,41.84 arc-45 12.17,41.91 19.53,41.91 20.09,41.35 arc45 20.27,41.27 U7.18 30.64,41.27 31.2,41.84 arc-45 31.38,41.91 38.73,41.91 39.3,41.35 arc45 39.48,41.27 U6.18 50.01,41.27 50.57,41.84 arc-45 50.75,41.91 v56.52,41.91 57.78,41.91 58.35,41.35 arc45 58.52,41.27 U5.18 69.22,41.27 69.78,41.84 arc-45 69.95,41.91 73.66,41.91 76.13,44.38 arc-45 76.31,44.45 SV1.36
  Bottom 0.127: v56.52,41.91 v56.52,67.31
D5  (via drill 0.3 pad 0.5)
  Top 0.127: U1.19 58.52,65.41 arc-45 58.35,65.48 57.78,66.04 v55.24,66.04 50.59,66.04 arc45 50.41,65.97 49.85,65.41 U2.19 39.48,65.41 arc-45 39.3,65.48 38.73,66.04 31.38,66.04 arc45 31.2,65.97 30.64,65.41 U3.19 | U4.19 11.43,40.01 11.99,40.57 arc-45 12.17,40.64 19.53,40.64 20.09,40.08 arc45 20.27,40.01 U7.19 30.64,40.01 31.2,40.57 arc-45 31.38,40.64 38.73,40.64 39.3,40.08 arc45 39.48,40.01 U6.19 50.01,40.01 50.57,40.57 arc-45 50.75,40.64 v55.24,40.64 57.78,40.64 58.35,40.08 arc45 58.52,40.01 U5.19 69.22,40.01 69.78,40.57 arc-45 69.95,40.64 74.14,40.64 75.33,41.84 arc-45 75.51,41.91 SV1.34
  Bottom 0.127: v55.24,40.64 v55.24,66.04
D6  (via drill 0.3 pad 0.5)
  Top 0.127: U1.20 58.52,64.14 arc-45 58.35,64.21 57.78,64.77 v50.8,64.77 50.59,64.77 arc45 50.41,64.7 49.85,64.14 U2.20 39.48,64.14 arc-45 39.3,64.21 38.73,64.77 31.38,64.77 arc45 31.2,64.7 30.64,64.14 U3.20 | U4.20 11.43,38.73 11.99,39.3 arc-45 12.17,39.37 19.53,39.37 20.09,38.81 arc45 20.27,38.73 U7.20 30.64,38.73 31.2,39.3 arc-45 31.38,39.37 38.73,39.37 39.3,38.81 arc45 39.48,38.73 U6.20 50.01,38.73 50.57,39.3 arc-45 50.75,39.37 v50.8,39.37 57.78,39.37 58.35,38.81 arc45 58.52,38.73 U5.20 69.22,38.73 69.78,39.3 arc-45 69.95,39.37 SV1.32
  Bottom 0.127: v50.8,39.37 v50.8,64.77
D7  (via drill 0.3 pad 0.5)
  Top 0.127: U1.21 58.52,62.87 arc-45 58.35,62.94 57.78,63.5 50.59,63.5 arc45 50.41,63.43 49.85,62.87 v49.05,62.87 U2.21 39.48,62.87 arc-45 39.3,62.94 38.73,63.5 31.38,63.5 arc45 31.2,63.43 30.64,62.87 U3.21 | U4.21 11.43,37.47 11.99,38.03 arc-45 12.17,38.1 19.53,38.1 20.09,37.54 arc45 20.27,37.47 U7.21 30.64,37.47 31.2,38.03 arc-45 31.38,38.1 38.73,38.1 39.3,37.54 arc45 39.48,37.47 U6.21 v49.05,37.47 50.01,37.47 50.57,38.03 arc-45 50.75,38.1 57.78,38.1 58.35,37.54 arc45 58.52,37.47 U5.21 69.22,37.47 69.78,38.03 arc-45 69.95,38.1 79.69,38.1 80.89,36.9 arc45 81.07,36.83 SV1.30
  Bottom 0.127: v49.05,62.87 v49.05,37.47
GND  (via drill 0.3 pad 0.5)
  Top 0.127: U3.16 38.73,67.94 39.3,67.38 arc45 39.48,67.31 49.85,67.31 50.41,67.87 arc-45 50.59,67.94 U2.16 v57.15,67.94 57.78,67.94 58.35,67.38 arc45 58.52,67.31 v66.04,67.31 69.22,67.31 69.78,67.87 arc-45 69.95,67.94 U1.16 | U5.16 69.95,42.55 arc45 69.78,42.47 69.22,41.91 58.52,41.91 arc-45 58.35,41.98 57.78,42.55 v57.15,42.55 U6.16 50.75,42.55 arc45 50.57,42.47 50.01,41.91 39.48,41.91 arc-45 39.3,41.98 38.73,42.55 U7.16 31.38,42.55 arc45 31.2,42.47 30.64,41.91 20.27,41.91 arc-45 20.09,41.98 19.53,42.55 U4.16
  Bottom 0.127: v57.15,42.55 v57.15,67.94
  other vias: 81.28,52.7 74.93,57.78 74.93,62.87 65.41,45.72 69.22,45.72 53.34,45.72 34.29,45.72 27.94,61.59 8.89,20.95 16.51,20.95 29.21,20.95 38.1,20.95 47.62,20.95 57.15,20.95 64.77,20.95 44.45,20.32 26.04,20.95 1.91,22.23 2.54,43.81 20.32,45.09 19.05,68.58 74.93,50.8 80.01,49.53 78.11,45.72
  pour Top (isolate 0.406): 87.63,0 82.55,0 64.77,17.78 1.27,17.78 arc-90 0,19.68 0,44.45 18.41,70.48 86.36,70.48 arc-90 87.63,69.22
  pour Bottom (isolate 0.406): 82.55,0 64.77,17.78 1.27,17.78 arc-90 0,19.68 0,44.45 18.41,70.48 86.36,70.48 arc-90 87.63,69.22 87.63,0
N$1
  Top 0.254: R1.2 LED1.A
N$5  (via drill 0.3 pad 0.5)
  other vias: 80.01,65.41
VCC  (via drill 0.3 pad 0.5)
  Top 0.254: U4.32 v6.51,23.5 11.43,23.5 11.99,24.06 arc-45 12.17,24.13 19.53,24.13 20.09,23.57 arc45 20.27,23.5 U7.32 v27.3,23.5 30.64,23.5 31.2,24.06 arc-45 31.38,24.13 38.73,24.13 39.3,23.57 arc45 39.48,23.5 U6.32 v45.4,23.5 50.01,23.5 50.57,24.06 arc-45 50.75,24.13 57.78,24.13 58.35,23.57 arc45 58.52,23.5 U5.32 v63.5,23.5 | U3.32 v25.08,48.9 30.64,48.9 31.2,49.46 arc-45 31.38,49.53 38.73,49.53 39.3,48.97 arc45 39.48,48.9 U2.32 v43.97,48.9 49.85,48.9 50.41,49.46 arc-45 50.59,49.53 57.78,49.53 58.35,48.97 arc45 58.52,48.9 U1.32 v63.5,48.9 | SV1.1 SV1.2 83.45,1.27 arc-45 83.27,1.34 65.41,19.21 v63.5,19.21 60.01,19.21 | 60.01,19.21 v45.4,19.21 40.8,19.21 | 40.8,19.21 v27.3,19.21 21.75,19.21 | 21.75,19.21 v6.51,19.21 2.86,19.21 arc-45 2.81,19.32 C7.1 | C6.1 21.86,19.43 arc-45 21.79,19.25 21.75,19.21 | C5.1 40.91,19.43 arc-45 40.84,19.25 40.8,19.21 | C4.1 59.96,19.32 arc45 60.01,19.21 | v8.73,43.97 21.91,43.97 | 21.91,43.97 v25.08,43.97 40.96,43.97 | 40.96,43.97 v43.97,43.97 60.01,43.97 | 60.01,43.97 v63.5,43.97 71.17,43.97 arc45 71.35,44.05 76.2,48.9 v77.63,48.9 77.67,48.93 arc45 77.74,49.11 C8.1 | 21.91,43.97 21.91,45.6 arc45 C3.1 | 40.96,43.97 40.96,45.6 arc45 C2.1 | 60.01,43.97 60.01,45.6 arc45 C1.1 | v76.36,65.56 76.36,67.04 arc-45 76.43,67.22 R1.1 | v76.36,55.88 U8.14
  Bottom 0.254: v63.5,19.21 v63.5,23.5 | v45.4,19.21 v45.4,23.5 | v27.3,19.21 v27.3,23.5 | v6.51,19.21 v6.51,23.5 6.51,41.65 arc-45 6.58,41.83 v8.73,43.97 | v63.5,43.97 v63.5,48.9 | v43.97,43.97 v43.97,48.9 | v25.08,43.97 v25.08,48.9 | v77.63,48.9 76.36,50.16 v76.36,55.88 v76.36,65.56

### Text on the board
tPlace: RetroDepot.net / Omega 4MB Module / Version 1.0